# Altium schematic sheet power.SchDoc
size A4; DocumentNumber: 3; SheetNumber: 3; PageSetup: Record=PageOptions|CenterHorizontal=True|CenterVertical=True|PrintScale=1.00|XCorrection=1.00|YCorrection=1.00|PrintKind=0|BorderSize=5000000|LeftOffset=0|BottomOffset=0|Orientation=2|PaperLength=1000|PaperWidth=1000|Scale=100|PaperSource=7|PrintQuality=-3|MediaType=1|DitherType=10|PrintScaleMode=1|PaperKind=Letter|PaperIndex=1
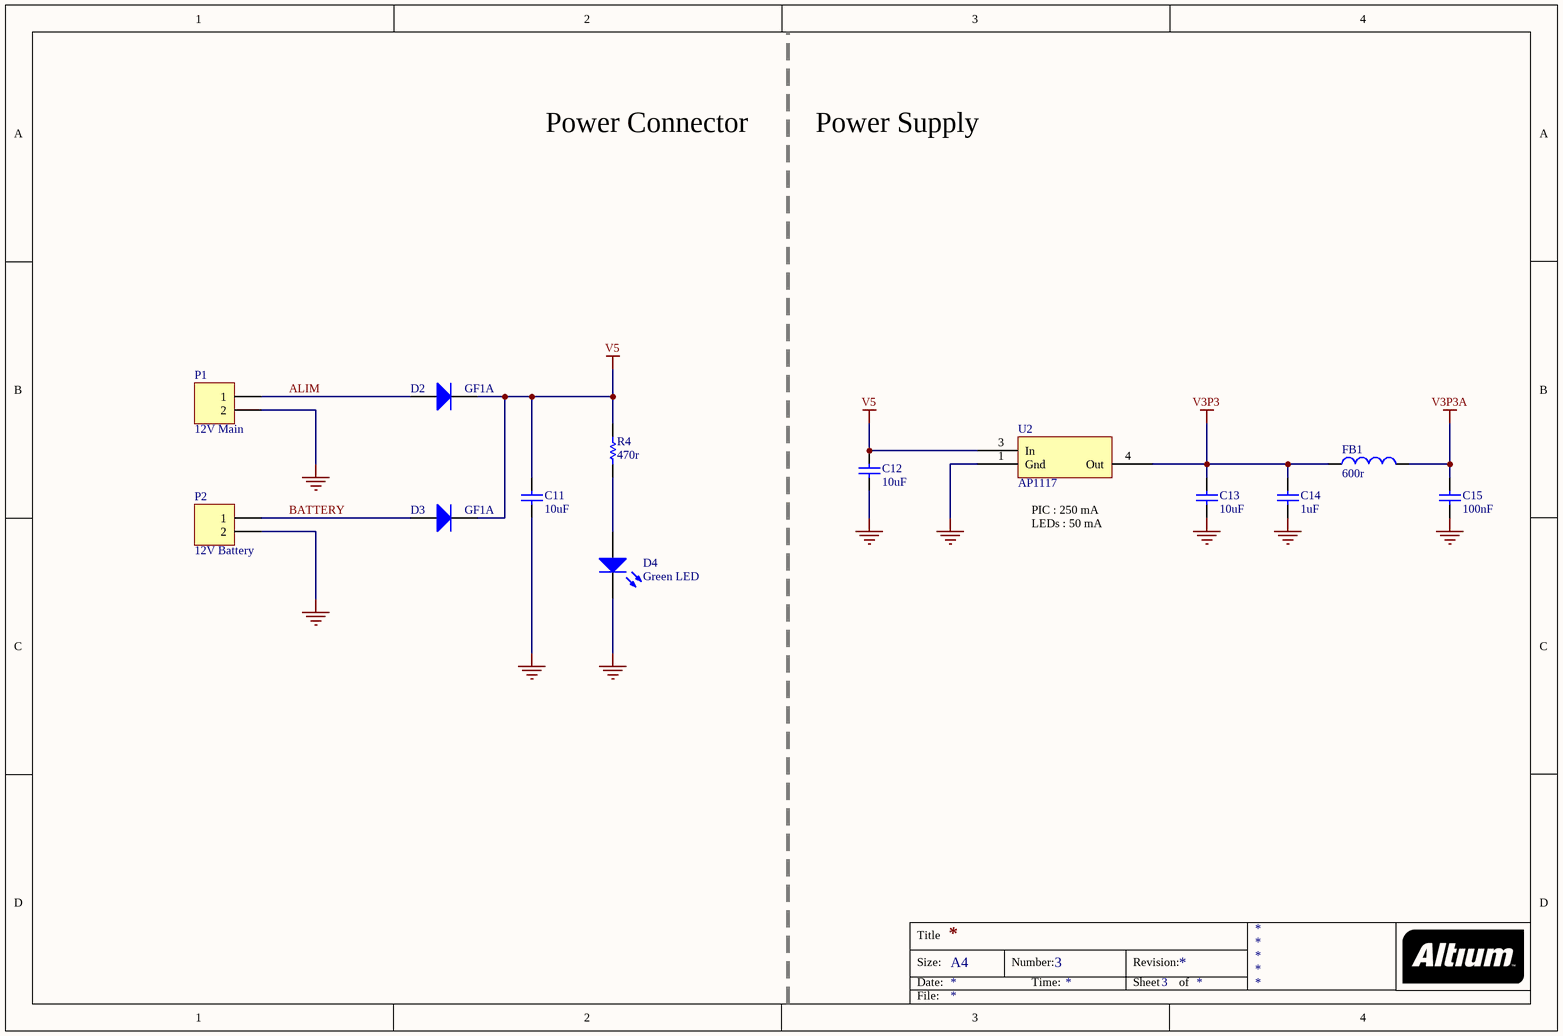
[diagram p0: power.SchDoc]

## Parts
C11  10uF  [CAPC2012N]
C12  10uF  [CAPC2012N]
C13  10uF  [CAPC2012N]
C14  1uF  [CAPC1608N]
C15  100nF  [CAPC1608N]
D2  GF1A  [SMA/DO-214AC_21]
D3  GF1A  [SMA/DO-214AC_21]
D4  Green LED  [LED 0805]
FB1  600r  [INDC1608AN]
P1  12V Main  [PHOENIX_1985195]
P2  12V Battery  [PHOENIX_1985195]
R4  470r  [RESC1608N]
U2  AP1117  [TD03B_N]

## Nets
GND: C11.1 C12.1 C13.1 C14.1 C15.1 D4.2(K) P1.2 P2.2 U2.1(Gnd)
V3P3: C13.2 C14.2 FB1.1 U2.4(Out)
V3P3A: C15.2 FB1.2
V5: C11.2 C12.2 D2.2(K) D3.2(K) R4.2 U2.3(In)
ALIM: D2.1(A) P1.1
BATTERY: D3.1(A) P2.1
NetD4_1: D4.1(A) R4.1

## Notes on the sheet
- Power Connector
- Power Supply
- (near U2) PIC : 250 mA
- LEDs : 50 mA
- Title
- Size:
- Date:
- A4
- Number:
- Time:
- Revision:
- Sheet
- of
- File:

## Library data of the parts
C11-C13 = Cap: Capacitor; Fabricant: TDK; RefFabricant: C2012X5R0J106M/1.25; Fournisseur: Farnell; RefFournisseur: 2309029; Precision: 6,3V X5R; Published: 8-Jun-2000; LatestRevisionDate: 17-Jul-2002; LatestRevisionNote: Re-released for DXP Platform.; PackageReference: RAD-0.3; Publisher: Altium Limited; PackageDescription: Radial Cap, Thru-Hole; 2 Leads; 0.3 in Pin Spacing; Value: 10uF
C14 = Cap: Capacitor; Precision: 6,3V X5R; Published: 8-Jun-2000; LatestRevisionDate: 17-Jul-2002; LatestRevisionNote: Re-released for DXP Platform.; PackageReference: RAD-0.3; Publisher: Altium Limited; PackageDescription: Radial Cap, Thru-Hole; 2 Leads; 0.3 in Pin Spacing; Value: 1uF
C15 = Cap: Capacitor; Value: 100pF; Precision: 50V X5R; Published: 8-Jun-2000; LatestRevisionDate: 17-Jul-2002; LatestRevisionNote: Re-released for DXP Platform.; PackageReference: RAD-0.3; Publisher: Altium Limited; PackageDescription: Radial Cap, Thru-Hole; 2 Leads; 0.3 in Pin Spacing
D2 D3 = Diode: Default Diode; Fabricant: VISHAY; RefFabricant: GF1A-E3/67A; Fournisseur: Farnell; RefFournisseur: 9549560; Published: 8-Jun-2000; LatestRevisionDate: 17-Jul-2002; LatestRevisionNote: Re-released for DXP Platform.; PackageVersion: Sep-1996; PackageReference: SMC; Publisher: Altium Limited; PackageDescription: DO-214-AB/SMC; 2 C-Bend Leads; Body 7.9 x 5.9 mm, inc. leads (LxW); Code_JEDEC: DO-214-AB
D4 = LED2: Typical INFRARED GaAs LED; Fabricant: KINGBRIGHT; RefFabricant: KPT-2012SGC; Fournisseur: Farnell; RefFournisseur: 2099239; Published: 8-Jun-2000; LatestRevisionDate: 17-Jul-2002; LatestRevisionNote: Re-released for DXP Platform.; PackageVersion: Feb-2002; PackageReference: 3.2X1.6X1.1; Publisher: Altium Limited; PackageDescription: SM LED; 2 Flat Leads
FB1 = Inductor: Code_IEC: 1005; Value: 10mH; Fabricant: Wurth; RefFabricant: 742792651; Fournisseur: Farnell; RefFournisseur: 1635706; Fabricant: Molex; Published: 8-Jun-2000; LatestRevisionDate: 29-May-2009; LatestRevisionNote: IPC-7351 Footprint Added.; PackageReference: 0402-A; Publisher: Altium Limited; PackageDescription: Chip Inductor; Code_JEITA: 0402
P1 P2 = Header 2: Header, 2-Pin; Fabricant: PHOENIX CONTACT; RefFabricant: PTSA 1.5/2-3,5-Z; Fournisseur: Farnell; RefFournisseur: 1792769; LatestRevisionDate: 17-Jul-2002; LatestRevisionNote: Re-released for DXP Platform.; Publisher: Altium Limited
R4 = Res1: Resistor; Value: 1K; Precision: 1%; Published: 8-Jun-2000; LatestRevisionDate: 17-Jul-2002; LatestRevisionNote: Re-released for DXP Platform.; PackageReference: AXIAL-0.3; Publisher: Altium Limited; PackageDescription: Axial Device, Thru-Hole; 2 Leads; 0.3 in Pin Spacing
U2 = AP1117: 1A LDO, 18V input, DPAK; Fabricant: DIODES INC; RefFabricant: AP1117D33G-13; Fournisseur: Farnell; RefFournisseur: 1825285